# Altium project Orient.PrjPcb (part 6 of 6)
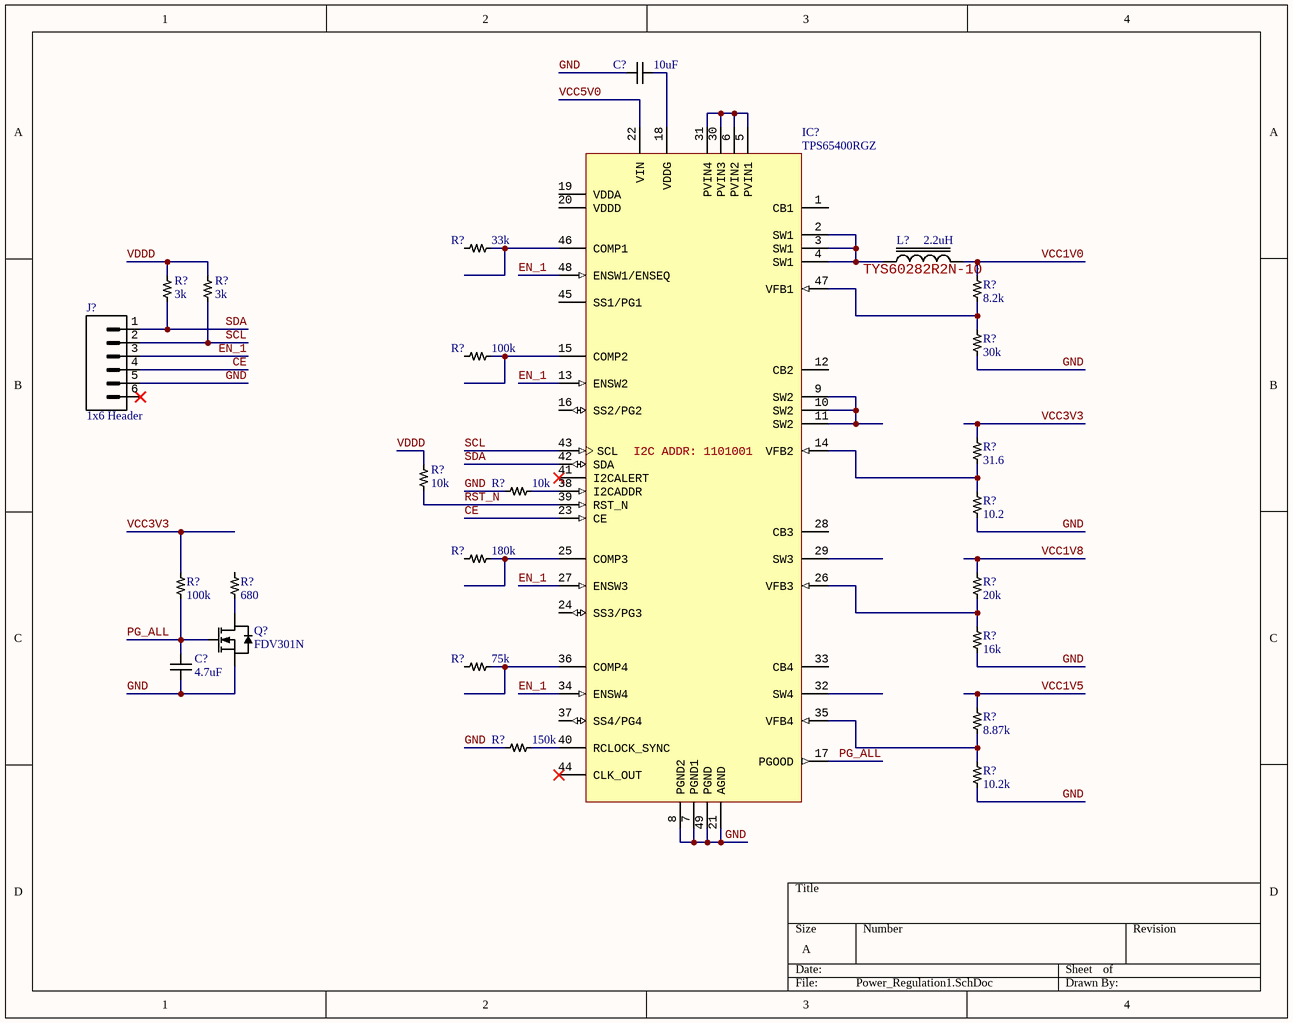
[diagram p10: Power_Regulation1.SchDoc]

## Nets that join several sheets
GND: PMODs_User_IO (44 pins), CHipKIT_IO (16 pins), Ethernet_SD_Card (IC?#1.47 IC?#1.P), HDMI (9 pins), DDR_MIO_Banks (6 pins), FPGA_Power (84 pins), DDR3_Memory (43 pins), Power_Regulation1 (14 pins)
CK_A0: CHipKIT_IO (J?#1.1 R?#28.2), FPGA_Banks_Anti_Alias (IC?#8.Y11)
CK_A1: CHipKIT_IO (J?#1.3 R?#27.2), FPGA_Banks_Anti_Alias (IC?#8.Y12)
CK_A2: CHipKIT_IO (J?#1.5 R?#26.2), FPGA_Banks_Anti_Alias (IC?#8.W11)
CK_A3: CHipKIT_IO (J?#1.7 R?#25.2), FPGA_Banks_Anti_Alias (IC?#8.V11)
CK_A4: CHipKIT_IO (J?#1.9 R?#24.2), FPGA_Banks_Anti_Alias (IC?#8.T5)
CK_A5: CHipKIT_IO (J?#1.11 R?#23.2), FPGA_Banks_Anti_Alias (IC?#8.U10)
CK_A6: CHipKIT_IO (J?#1.2), FPGA_Banks_Anti_Alias (R?#129.1)
CK_A7: CHipKIT_IO (J?#1.4), FPGA_Banks_Anti_Alias (R?#130.1)
CK_A8: CHipKIT_IO (J?#1.6), FPGA_Banks_Anti_Alias (R?#131.1)
CK_A9: CHipKIT_IO (J?#1.8), FPGA_Banks_Anti_Alias (R?#132.1)
CK_A10: CHipKIT_IO (J?#1.10), FPGA_Banks_Anti_Alias (R?#133.1)
CK_A11: CHipKIT_IO (J?#1.12), FPGA_Banks_Anti_Alias (R?#134.1)
CK_AN0_N: CHipKIT_IO (C?#1.2 R?#36.1), FPGA_Banks_Anti_Alias (IC?#10.D18)
CK_AN0_P: CHipKIT_IO (C?#1.1 R?#31.1), FPGA_Banks_Anti_Alias (IC?#10.E17)
CK_AN1_N: CHipKIT_IO (C?#2.2 R?#47.1), FPGA_Banks_Anti_Alias (IC?#10.E19)
CK_AN1_P: CHipKIT_IO (C?#2.1 R?#43.1), FPGA_Banks_Anti_Alias (IC?#10.E18)
CK_AN2_N: CHipKIT_IO (C?#3.2 R?#49.1), FPGA_Banks_Anti_Alias (IC?#10.J14)
CK_AN2_P: CHipKIT_IO (C?#3.1 R?#48.1), FPGA_Banks_Anti_Alias (IC?#10.K14)
CK_AN3_N: CHipKIT_IO (C?#4.2 R?#61.1), FPGA_Banks_Anti_Alias (IC?#10.J16)
CK_AN3_P: CHipKIT_IO (C?#4.1 R?#56.1), FPGA_Banks_Anti_Alias (IC?#10.K16)
CK_AN4_N: CHipKIT_IO (C?#5.2 R?#69.1), FPGA_Banks_Anti_Alias (IC?#10.H20)
CK_AN4_P: CHipKIT_IO (C?#5.1 R?#68.1), FPGA_Banks_Anti_Alias (IC?#10.J20)
CK_AN5_N: CHipKIT_IO (C?#6.2 R?#71.1), FPGA_Banks_Anti_Alias (IC?#10.G20)
CK_AN5_P: CHipKIT_IO (C?#6.1 R?#70.1), FPGA_Banks_Anti_Alias (IC?#10.G19)
CK_IO0: CHipKIT_IO (R?#50.1), FPGA_Banks_Anti_Alias (IC?#9.T14)
CK_IO1: CHipKIT_IO (R?#52.1), FPGA_Banks_Anti_Alias (IC?#9.U12)
CK_IO2: CHipKIT_IO (R?#54.1), FPGA_Banks_Anti_Alias (IC?#9.U13)
CK_IO3: CHipKIT_IO (R?#57.1), FPGA_Banks_Anti_Alias (IC?#9.V13)
CK_IO4: CHipKIT_IO (R?#59.1), FPGA_Banks_Anti_Alias (IC?#9.V15)
CK_IO5: CHipKIT_IO (R?#62.1), FPGA_Banks_Anti_Alias (IC?#9.T15)
CK_IO6: CHipKIT_IO (R?#64.1), FPGA_Banks_Anti_Alias (IC?#9.R16)
CK_IO7: CHipKIT_IO (R?#66.1), FPGA_Banks_Anti_Alias (IC?#9.U17)
CK_IO8: CHipKIT_IO (R?#29.1), FPGA_Banks_Anti_Alias (IC?#9.V17)
CK_IO9: CHipKIT_IO (R?#32.1), FPGA_Banks_Anti_Alias (IC?#9.V18)
CK_IO10: CHipKIT_IO (R?#34.1), FPGA_Banks_Anti_Alias (IC?#9.T16)
CK_IO11: CHipKIT_IO (R?#37.1), FPGA_Banks_Anti_Alias (IC?#9.R17)
CK_IO12: CHipKIT_IO (R?#39.1), FPGA_Banks_Anti_Alias (IC?#9.P18)
CK_IO13: CHipKIT_IO (R?#41.1), FPGA_Banks_Anti_Alias (IC?#9.N17)
CK_IO26: CHipKIT_IO (R?#51.2), FPGA_Banks_Anti_Alias (IC?#8.U5)
CK_IO27: CHipKIT_IO (R?#53.2), FPGA_Banks_Anti_Alias (IC?#8.V5)
CK_IO28: CHipKIT_IO (R?#55.2), FPGA_Banks_Anti_Alias (IC?#8.V6)
CK_IO29: CHipKIT_IO (R?#58.2), FPGA_Banks_Anti_Alias (IC?#8.U7)
CK_IO30: CHipKIT_IO (R?#60.2), FPGA_Banks_Anti_Alias (IC?#8.V7)
CK_IO31: CHipKIT_IO (R?#63.2), FPGA_Banks_Anti_Alias (IC?#8.U8)
CK_IO32: CHipKIT_IO (R?#65.2), FPGA_Banks_Anti_Alias (IC?#8.V8)
CK_IO33: CHipKIT_IO (R?#67.2), FPGA_Banks_Anti_Alias (IC?#8.V10)
CK_IO34: CHipKIT_IO (R?#30.2), FPGA_Banks_Anti_Alias (IC?#8.W10)
CK_IO35: CHipKIT_IO (R?#33.2), FPGA_Banks_Anti_Alias (IC?#8.W6)
CK_IO36: CHipKIT_IO (R?#35.2), FPGA_Banks_Anti_Alias (IC?#8.Y6)
CK_IO37: CHipKIT_IO (R?#38.2), FPGA_Banks_Anti_Alias (IC?#8.Y7)
CK_IO38: CHipKIT_IO (R?#40.2), FPGA_Banks_Anti_Alias (IC?#8.W8)
CK_IO39: CHipKIT_IO (R?#42.2), FPGA_Banks_Anti_Alias (IC?#8.Y8)
CK_IO40: CHipKIT_IO (R?#44.2), FPGA_Banks_Anti_Alias (IC?#8.W9)
CK_IO41: CHipKIT_IO (R?#46.2), FPGA_Banks_Anti_Alias (IC?#8.Y9)
CK_IOA: CHipKIT_IO (R?#45.1), FPGA_Banks_Anti_Alias (IC?#8.Y13)
CK_MISO: CHipKIT_IO (R?#78.1), FPGA_Banks_Anti_Alias (IC?#9.W15)
CK_MOSI: CHipKIT_IO (R?#80.2), FPGA_Banks_Anti_Alias (IC?#9.T12)
CK_RST: CHipKIT_IO (J?#6.3), DDR_MIO_Banks (IC?#5.D9)
CK_SCK: CHipKIT_IO (R?#79.1), FPGA_Banks_Anti_Alias (IC?#10.H15)
CK_SCL: CHipKIT_IO (J?#2.2 R?#22.1), FPGA_Banks_Anti_Alias (IC?#9.P16)
CK_SDA: CHipKIT_IO (J?#2.1 R?#21.1), FPGA_Banks_Anti_Alias (IC?#9.P15)
CK_SS: CHipKIT_IO (R?#81.1), FPGA_Banks_Anti_Alias (IC?#10.F16)
DDR3_A0: DDR_MIO_Banks (IC?#7.N2), DDR3_Memory (IC?#13.N3)
DDR3_A1: DDR_MIO_Banks (IC?#7.K2), DDR3_Memory (IC?#13.P7)
DDR3_A2: DDR_MIO_Banks (IC?#7.M3), DDR3_Memory (IC?#13.P3)
DDR3_A3: DDR_MIO_Banks (IC?#7.K3), DDR3_Memory (IC?#13.N2)
DDR3_A4: DDR_MIO_Banks (IC?#7.M4), DDR3_Memory (IC?#13.P8)
DDR3_A5: DDR_MIO_Banks (IC?#7.L1), DDR3_Memory (IC?#13.P2)
DDR3_A6: DDR_MIO_Banks (IC?#7.L4), DDR3_Memory (IC?#13.R8)
DDR3_A7: DDR_MIO_Banks (IC?#7.K4), DDR3_Memory (IC?#13.R2)
DDR3_A8: DDR_MIO_Banks (IC?#7.K1), DDR3_Memory (IC?#13.T8)
DDR3_A9: DDR_MIO_Banks (IC?#7.J4), DDR3_Memory (IC?#13.R3)
DDR3_A10: DDR_MIO_Banks (IC?#7.F5), DDR3_Memory (IC?#13.L7)
DDR3_A11: DDR_MIO_Banks (IC?#7.G4), DDR3_Memory (IC?#13.R7)
DDR3_A12: DDR_MIO_Banks (IC?#7.E4), DDR3_Memory (IC?#13.N7)
DDR3_A13: DDR_MIO_Banks (IC?#7.D4), DDR3_Memory (IC?#13.T3)
DDR3_A14: DDR_MIO_Banks (IC?#7.F4), DDR3_Memory (IC?#13.T7)
DDR3_BA0: DDR_MIO_Banks (IC?#7.L5), DDR3_Memory (IC?#13.M2)
DDR3_BA1: DDR_MIO_Banks (IC?#7.R4), DDR3_Memory (IC?#13.N8)
DDR3_BA2: DDR_MIO_Banks (IC?#7.J5), DDR3_Memory (IC?#13.M3)
DDR3_CAS: DDR_MIO_Banks (IC?#7.P5), DDR3_Memory (IC?#13.K3)
DDR3_CKE0: DDR_MIO_Banks (IC?#7.N3), DDR3_Memory (IC?#13.K9)
DDR3_CS: DDR_MIO_Banks (IC?#7.N1), DDR3_Memory (IC?#13.L2)
DDR3_D0: DDR_MIO_Banks (IC?#7.E3), DDR3_Memory (IC?#13.E3)
DDR3_D1: DDR_MIO_Banks (IC?#7.H3), DDR3_Memory (IC?#13.F7)
DDR3_D2: DDR_MIO_Banks (IC?#7.E2), DDR3_Memory (IC?#13.F2)
DDR3_D3: DDR_MIO_Banks (IC?#7.H1), DDR3_Memory (IC?#13.F8)
DDR3_D4: DDR_MIO_Banks (IC?#7.J3), DDR3_Memory (IC?#13.H3)
DDR3_D5: DDR_MIO_Banks (IC?#7.J1), DDR3_Memory (IC?#13.H8)
DDR3_D6: DDR_MIO_Banks (IC?#7.G3), DDR3_Memory (IC?#13.G2)
DDR3_D7: DDR_MIO_Banks (IC?#7.H2), DDR3_Memory (IC?#13.H7)
DDR3_D8: DDR_MIO_Banks (IC?#7.E1), DDR3_Memory (IC?#13.D7)
DDR3_D9: DDR_MIO_Banks (IC?#7.D3), DDR3_Memory (IC?#13.C3)
DDR3_D10: DDR_MIO_Banks (IC?#7.D1), DDR3_Memory (IC?#13.C8)
DDR3_D11: DDR_MIO_Banks (IC?#7.C3), DDR3_Memory (IC?#13.C2)
DDR3_D12: DDR_MIO_Banks (IC?#7.B3), DDR3_Memory (IC?#13.A7)
DDR3_D13: DDR_MIO_Banks (IC?#7.A4), DDR3_Memory (IC?#13.A2)
DDR3_D14: DDR_MIO_Banks (IC?#7.C1), DDR3_Memory (IC?#13.B8)
DDR3_D15: DDR_MIO_Banks (IC?#7.A2), DDR3_Memory (IC?#13.A3)
DDR3_DM0: DDR_MIO_Banks (IC?#7.F1), DDR3_Memory (IC?#13.E7)
DDR3_DM1: DDR_MIO_Banks (IC?#7.A1), DDR3_Memory (IC?#13.D3)
DDR3_DQS0_N: DDR_MIO_Banks (IC?#7.F2), DDR3_Memory (IC?#13.G3)
DDR3_DQS0_P: DDR_MIO_Banks (IC?#7.G2), DDR3_Memory (IC?#13.F3)
DDR3_DQS1_N: DDR_MIO_Banks (IC?#7.B2), DDR3_Memory (IC?#13.B7)
DDR3_DQS1_P: DDR_MIO_Banks (IC?#7.C2), DDR3_Memory (IC?#13.C7)
DDR3_ODT0: DDR_MIO_Banks (IC?#7.N5), DDR3_Memory (IC?#13.K1)
DDR3_RAS: DDR_MIO_Banks (IC?#7.P4), DDR3_Memory (IC?#13.J3)
DDR3_RESET: DDR_MIO_Banks (IC?#7.B4), DDR3_Memory (IC?#13.T2 R?#136.1)
DDR3_VREF: DDR_MIO_Banks (C?#11.1 R?#118.1 R?#120.2), DDR3_Memory (C?#70.2 C?#71.1 IC?#13.H1 IC?#13.M8)
DDR3_WE: DDR_MIO_Banks (IC?#7.M5), DDR3_Memory (IC?#13.L3)
HDMI_TX_CEC: HDMI (D?#21.1 J?#10.13), FPGA_Banks_Anti_Alias (IC?#10.G15)
HDMI_TX_CLK_N: HDMI (J?#10.12 R?#104.1), FPGA_Banks_Anti_Alias (IC?#10.L17)
HDMI_TX_CLK_P: HDMI (J?#10.10 R?#105.1), FPGA_Banks_Anti_Alias (IC?#10.L16)
HDMI_TX_D0_N: HDMI (J?#10.9 R?#106.1), FPGA_Banks_Anti_Alias (IC?#10.K18)
HDMI_TX_D0_P: HDMI (J?#10.7 R?#107.1), FPGA_Banks_Anti_Alias (IC?#10.K17)
HDMI_TX_D1_N: HDMI (J?#10.6 R?#108.1), FPGA_Banks_Anti_Alias (IC?#10.J19)
HDMI_TX_D1_P: HDMI (J?#10.4 R?#109.1), FPGA_Banks_Anti_Alias (IC?#10.K19)
HDMI_TX_D2_N: HDMI (J?#10.3 R?#110.1), FPGA_Banks_Anti_Alias (IC?#10.H18)
HDMI_TX_D2_P: HDMI (J?#10.1 R?#111.1), FPGA_Banks_Anti_Alias (IC?#10.J18)
HDMI_TX_HPDN: HDMI (J?#10.18), FPGA_Banks_Anti_Alias (IC?#9.R19)
HDMI_TX_SCL: HDMI (IC?#3.3 R?#114.1), FPGA_Banks_Anti_Alias (IC?#10.M17)
HDMI_TX_SDA: HDMI (IC?#3.4 R?#115.1), FPGA_Banks_Anti_Alias (IC?#10.M18)
PG_ALL: DDR_MIO_Banks (IC?#5.C7), Power_Regulation1 (C?#92.1 IC?#14.17 Q?#2.1 R?#148.1)
VCC1V0: FPGA_Power (32 pins), Power_Regulation1 (L?.2 R?#140.2)
VCC1V5: DDR_MIO_Banks (R?#118.2), FPGA_Power (16 pins), DDR3_Memory (38 pins), Power_Regulation1 (R?#153.2)
VCC1V8: DDR_MIO_Banks (R?#119.2), FPGA_Power (26 pins), Power_Regulation1 (R?#150.2)
VCC3V3: PMODs_User_IO (P?#1.12 P?#2.12), CHipKIT_IO (J?#6.2 J?#6.4 R?#21.2 R?#22.2), HDMI (13 pins), DDR_MIO_Banks (R?#122.1), FPGA_Power (41 pins), Power_Regulation1 (R?#143.2 R?#148.2)
VCC5V0: CHipKIT_IO (J?#6.5), Power_Regulation1 (IC?#14.22)